# Altium schematic sheet viout.SchDoc: VIout
size A3; Organization: 合肥弗雷电子; Address1: 玉兰达到14号D栋3楼; Address2: 肥西县桃花镇; Address3: 合肥市; Address4: 安徽省; Revision: betaV1.0; SheetNumber: 1; SheetTotal: 1
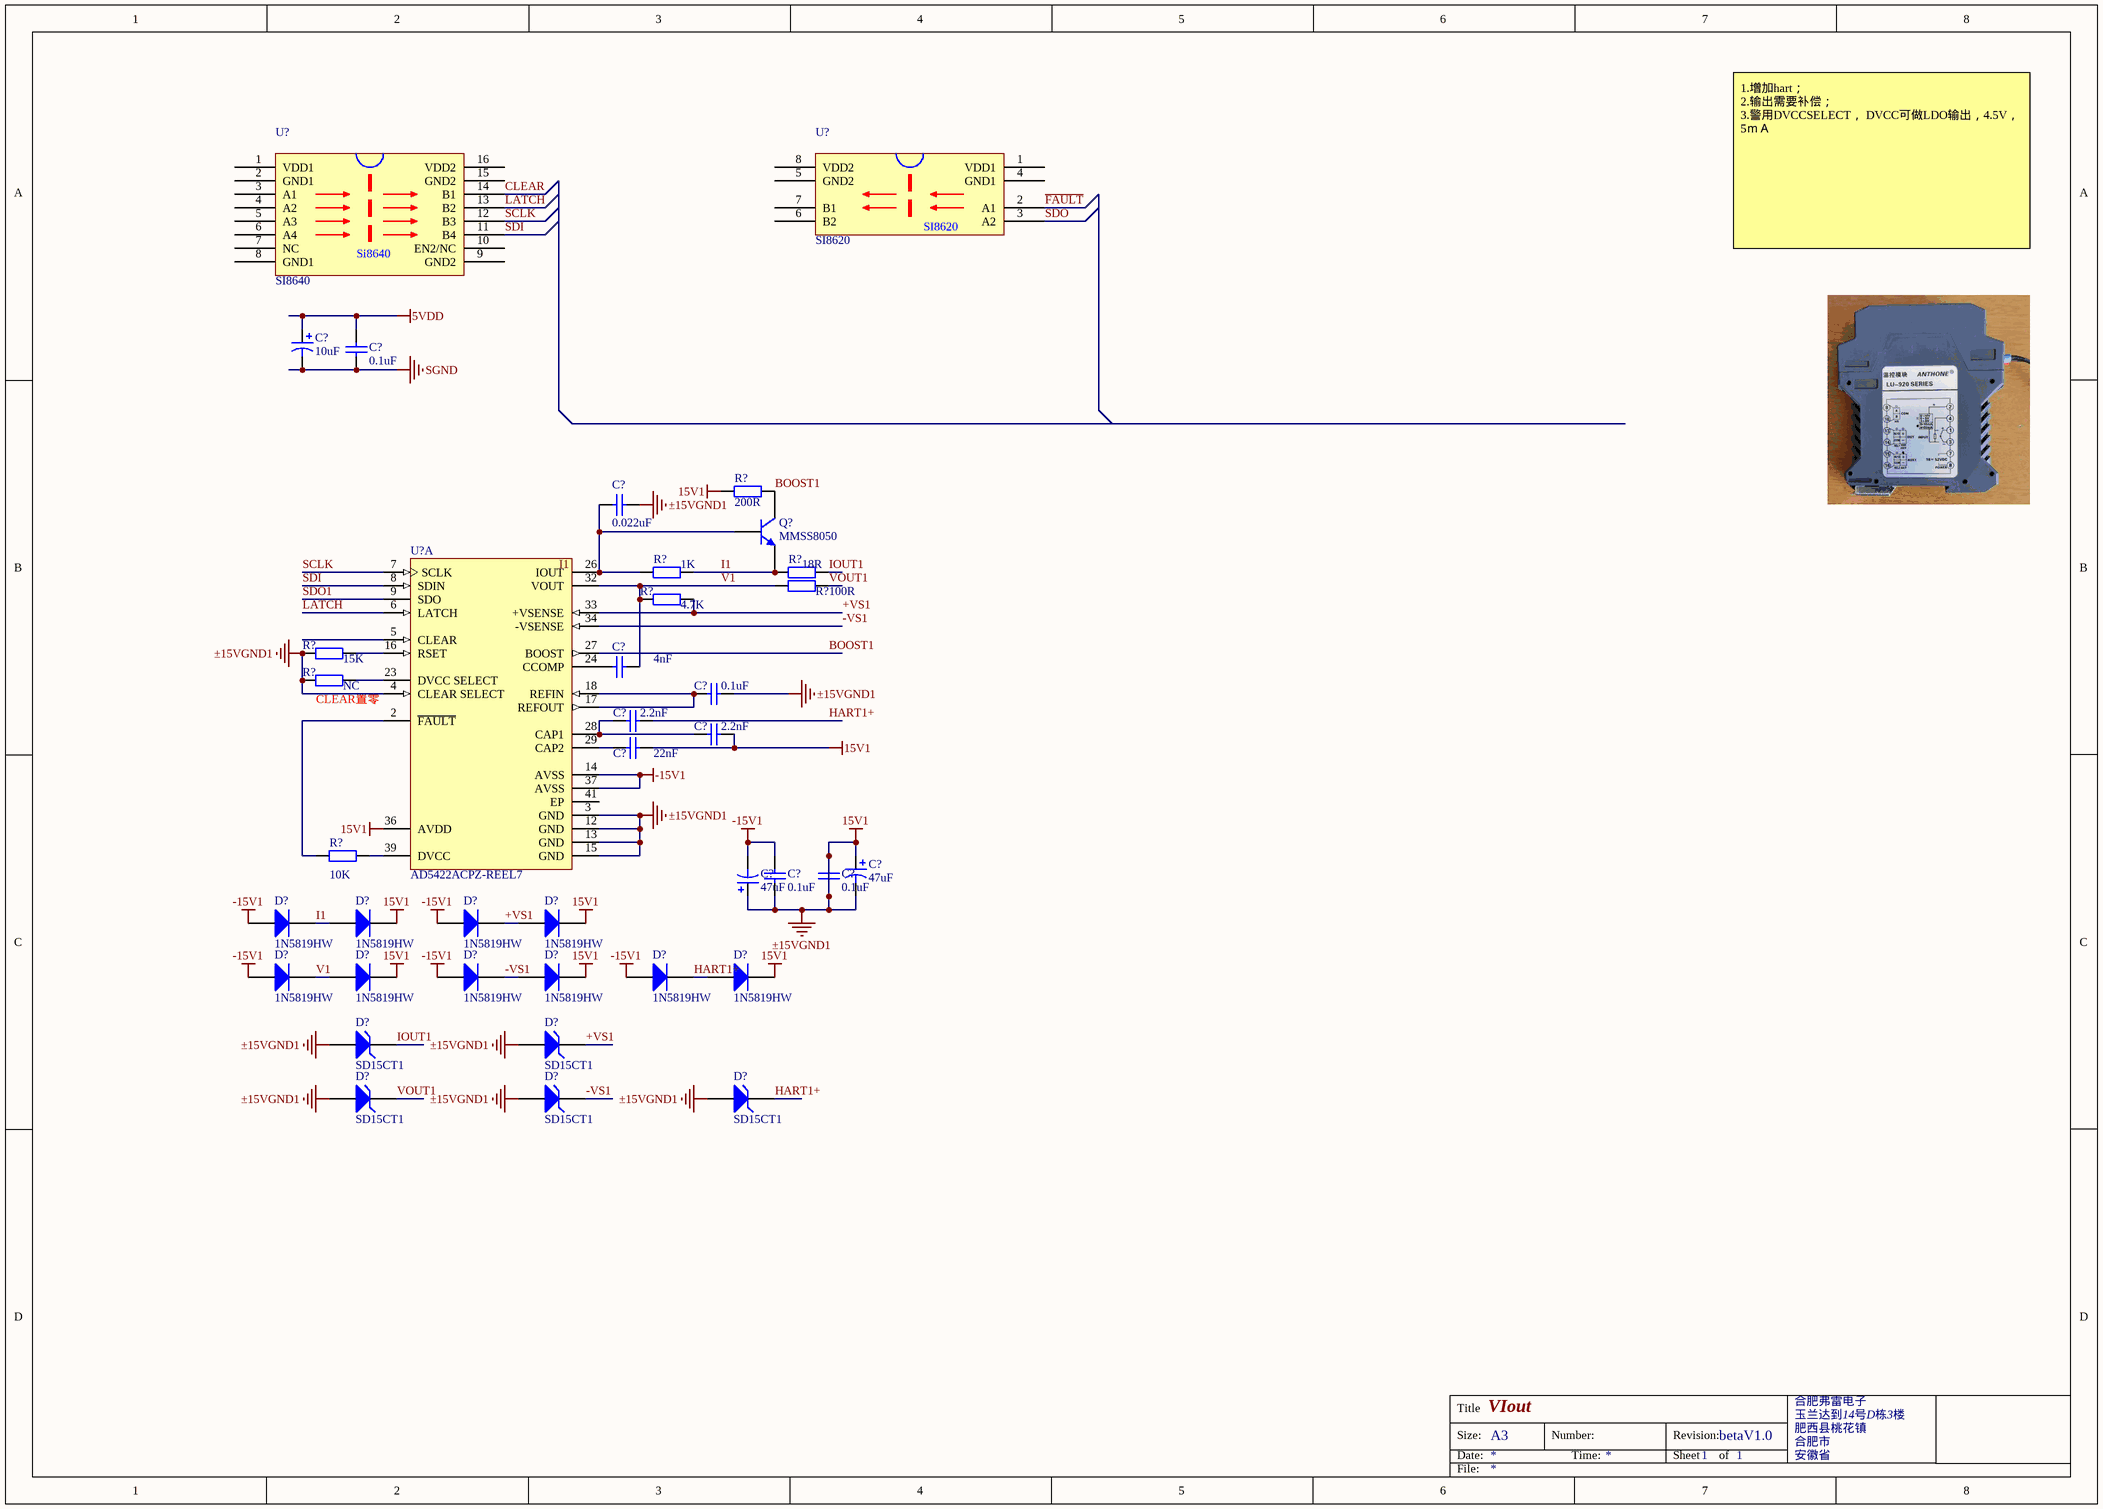
[diagram p0: viout.SchDoc]

## Parts
(Parts that share a designator on the sheet are numbered #1, #2 ... from top to bottom, then left to right.)
C?#1  value 10uF  [CB]  (hidden comment: T494B106M006AHAUTO)
C?#2  value 0.1uF  [0805c]  (hidden comment: CC0805MRX7R9BB104)
C?#3  value 0.022uF  [0805c]  (hidden comment: CC0805MRX7R9BB103)
C?#4  value 4nF  [0805c]
C?#5  value 0.1uF  [0805c]  (hidden comment: CC0805MRX7R9BB104)
C?#6  value 2.2nF  [0805c]
C?#7  value 2.2nF  [0805c]
C?#8  value 22nF  [0805c]
C?#9  value 0.1uF  [0805c]  (hidden comment: CC0805MRX7R9BB104)
C?#10  value 0.1uF  [0805c]  (hidden comment: CC0805MRX7R9BB104)
C?#11  value 47uF  [CB]  (hidden comment: T494B476K025ATAUTO)
C?#12  value 47uF  [CB]  (hidden comment: T494B476K025ATAUTO)
D?#1  1N5819HW  [sod123]
D?#2  1N5819HW  [sod123]
D?#3  1N5819HW  [sod123]
D?#4  1N5819HW  [sod123]
D?#5  1N5819HW  [sod123]
D?#6  1N5819HW  [sod123]
D?#7  1N5819HW  [sod123]
D?#8  1N5819HW  [sod123]
D?#9  1N5819HW  [sod123]
D?#10  1N5819HW  [sod123]
D?#11  SD15CT1  [sod323]
D?#12  SD15CT1  [sod323]
D?#13  SD15CT1  [sod323]
D?#14  SD15CT1  [sod323]
D?#15  SD15CT1  [sod323]
Q?  MMSS8050  [SOT-23-BJT]
R?#1  value 200R  [0805R]
R?#2  value 1K  [0805R]  (hidden comment: RC0805JR-071KL)
R?#3  value 18R  [0805R]
R?#4  value 100R  [0805R]
R?#5  value 4.7K  [0805R]
R?#6  value 15K  [0805R]  (hidden comment: E192)
R?#7  value NC  [0805R]  (hidden comment: E192)
R?#8  value 10K  [0805R]  (hidden comment: RC0805JR-0710KL)
U?#1  SI8640
U?#2  SI8620
U?#3  AD5422ACPZ-REEL7  [CP-40-1_N]  (part A of 2)

## Nets
5VDD: C?#1.1 C?#2.2
15V1: C?#3.1 C?#5.2 C?#7.1 C?#8.1 C?#9.2 C?#10.1 C?#10.2 C?#11.1 C?#11.2 C?#12.1 D?#2.2(K) D?#4.2(K) D?#6.2(K) D?#8.2(K) D?#10.2(K) D?#11.1(A) D?#12.1(A) D?#13.1(A) D?#14.1(A) D?#15.1(A) R?#1.2 R?#6.1 R?#7.1 U?#3.3(GND) U?#3.4(CLEAR_SELECT) U?#3.12(GND) U?#3.13(GND) U?#3.15(GND) U?#3.36(AVDD)  [also labelled ±15VGND1]
-15V1: C?#9.1 C?#12.2 D?#1.1(A) D?#3.1(A) D?#5.1(A) D?#7.1(A) D?#9.1(A) U?#3.14(AVSS) U?#3.37(AVSS)
SGND: C?#1.2 C?#2.1
+VS1: D?#3.2(K) D?#4.1(A) D?#12.2(K) R?#5.2 U?#3.33(+VSENSE)
-VS1: D?#7.2(K) D?#8.1(A) D?#14.2(K) U?#3.34(-VSENSE)
BOOST1: Q?.1(C) R?#1.1 U?#3.27(BOOST)
CLEAR: U?#1.14(B1)
~{FAULT}: U?#2.2(A1)
HART1+: C?#6.1 D?#9.2(K) D?#10.1(A) D?#15.2(K)
I1: D?#1.2(K) D?#2.1(A) Q?.3(E) R?#2.2 R?#3.1
IOUT1: D?#11.2(K) R?#3.2
LATCH: U?#1.13(B2) U?#3.6(LATCH)
SCLK: U?#1.12(B3) U?#3.7(SCLK)
SDI: U?#1.11(B4) U?#3.8(SDIN)
SDO: U?#2.3(A2)
SDO1: U?#3.9(SDO)
V1: C?#4.2 D?#5.2(K) D?#6.1(A) R?#4.1 R?#5.1 U?#3.32(VOUT)
VOUT1: D?#13.2(K) R?#4.2
NetC?#3_2: C?#3.2 Q?.2(B) R?#2.1 U?#3.26(IOUT)
NetC?#4_1: C?#4.1 U?#3.24(CCOMP)
NetC?#5_1: C?#5.1 U?#3.17(REFOUT) U?#3.18(REFIN)
NetC?#6_2: C?#6.2 C?#7.2 U?#3.28(CAP1)
NetC?#8_2: C?#8.2 U?#3.29(CAP2)
NetR?#6_2: R?#6.2 U?#3.16(RSET)
NetR?#7_2: R?#7.2 U?#3.23(DVCC_SELECT)
NetR?#8_1: R?#8.1 U?#3.39(DVCC)
NetR?#8_2: R?#8.2 U?#3.2(~{FAULT})

Not connected (* = marked no-connect by the designer): U?#1 1(VDD1) 2(GND1) 3(A1) 4(A2) 5(A3) 6(A4) 7(NC) 8(GND1) 9(GND2) 10(EN2/NC) 15(GND2) 16(VDD2); U?#2 1(VDD1) 4(GND1) 5(GND2) 6(B2) 7(B1) 8(VDD2); U?#3 5(CLEAR) 41(EP)

## Notes on the sheet
- 1.增加hart；
  2.输出需要补偿；
  3.警用DVCCSELECT， DVCC可做LDO输出，4.5V，5ｍＡ
- (near R?#7) CLEAR置零
- Labels drawn without touching a wire or pin: I1
- Title
- Size:
- Date:
- A3
- Number:
- Time:
- Revision:
- Sheet
- of
- File:
- (in symbol SI8640) Si8640

## Library data of the parts
C?#1 C?#11 C?#12 = Cap Pol1: Polarized Capacitor (Radial); Published: 8-Jun-2000; LatestRevisionDate: 17-Jul-2002; LatestRevisionNote: Re-released for DXP Platform.; PackageReference: RB7.6-15; Publisher: Altium Limited; PackageDescription: Polarized Capacitor (Radial); 2 Leads
C?#2-C?#10 = Cap: Capacitor; Published: 8-Jun-2000; LatestRevisionDate: 17-Jul-2002; LatestRevisionNote: Re-released for DXP Platform.; PackageReference: RAD-0.3; Publisher: Altium Limited; PackageDescription: Radial Cap, Thru-Hole; 2 Leads; 0.3 in Pin Spacing
D?#1-D?#10 = Diode: Default Diode; Published: 8-Jun-2000; LatestRevisionDate: 17-Jul-2002; LatestRevisionNote: Re-released for DXP Platform.; PackageVersion: Sep-1996; PackageReference: SMC; Publisher: Altium Limited; PackageDescription: DO-214-AB/SMC; 2 C-Bend Leads; Body 7.9 x 5.9 mm, inc. leads (LxW); Code_JEDEC: DO-214-AB
D?#11-D?#15 = D Zener: Zener Diode; Published: 8-Jun-2000; LatestRevisionDate: 17-Jul-2002; LatestRevisionNote: Re-released for DXP Platform.; PackageReference: DIODE-0.7; Publisher: Altium Limited; PackageDescription: Diode, Thru-Hole; 2 Leads; 0.7 in Pin Spacing
Q? = NPN: NPN Bipolar Transistor; Published: 8-Jun-2000; LatestRevisionDate: 17-Jul-2002; LatestRevisionNote: Re-released for DXP Platform.; PackageReference: TO-226-AA; Publisher: Altium Limited; PackageDescription: TO, Flat Index; 3 In-Line, Axial Leads; Body Dia. 4.8mm; Leads 0.55 x 0.51 mm (max); Code_JEDEC: TO-226-AA
R?#1-R?#8 = Res2: Resistor; Published: 8-Jun-2000; LatestRevisionDate: 17-Jul-2002; LatestRevisionNote: Re-released for DXP Platform.; PackageReference: AXIAL-0.4; Publisher: Altium Limited; PackageDescription: Axial Device, Thru-Hole; 2 Leads; 0.4 in Pin Spacing
U?#3 = AD5422ACPZ-REEL7: Single 16-Bit Current Source Digital-to-Analog Converter with Serial Interface and HART Connectivity, -40 to +85 degC, CP-40-1, Pb-Free, Reel; Generic Part Number: AD5422; Manufacturer: Analog Devices; # DAC Outputs: 1; Max V+: 40V; Op Pwr Diss: 158mW; Resolution (Bits): 16; Settling Time: 18祍; Single Supply: No; DatasheetVersion: Rev.E; PackageVersion: Oct-2006; PackageReference: CP-40-1; PackageDescription: 40-Pin Lead Frame Chip Scale Package [LFCSP_VQ] Very Thin Quad; Supplier 1: Digi-Key; Supplier Part Number 1: AD5422ACPZ-REEL7TR-ND; Supplier 2: Digi-Key; Supplier Part Number 2: AD5422ACPZ-REEL7CT-ND; Supplier 3: Digi-Key; Supplier Part Number 3: AD5422ACPZ-REEL7DKR-ND; Supplier 4: Mouser; Supplier Part Number 4: 584-AD5422ACPZ-R7; Packing: Reel; RoHS: Y; Mounting Technology: Surface Mount; Code_JEDEC: MO-220-VJJD-2; PartNumber: AD5422ACPZ-REEL7; ComponentLink1Description: Manufacturer URL; ComponentLink1URL: http://www.analog.com/en/index.html; ComponentLink2Description: Datasheet; ComponentLink2URL: http://www.analog.com/static/imported-files/data_sheets/AD5412_5422.pdf; ComponentLink3Description: Package Specification; ComponentLink3URL: http://www.analog.com/static/imported-files/packages/PKG_PDF/LFCSP(CP)/CP_40_1.pdf; ComponentLink4Description: Product URL; ComponentLink4URL: http://www.analog.com/en/digital-to-analog-converters/da-converters/ad5422/products/product.html; ComponentLink5Description: Reference Design URL; ComponentLink5URL: http://www.analog.com/en/digital-to-analog-converters/da-converters/ad5422/products/product.html#prod_cross_sell